# Altium schematic sheet jlink.schdoc
size 309 x 182 mm; Symbol: Sheet-Symbol_A4; Device: Sheet-Symbol_A4; @Page Name: P1; @Create Date: 2023-07-17; @Page Count: 1; @Page No: 1; @Project Name: JLINK_OB_Moriarty; @Schematic Name: Schematic1; @Update Date: 2023-07-19; Company: 黄佩奇; Page Size: A4; Version: V1.0
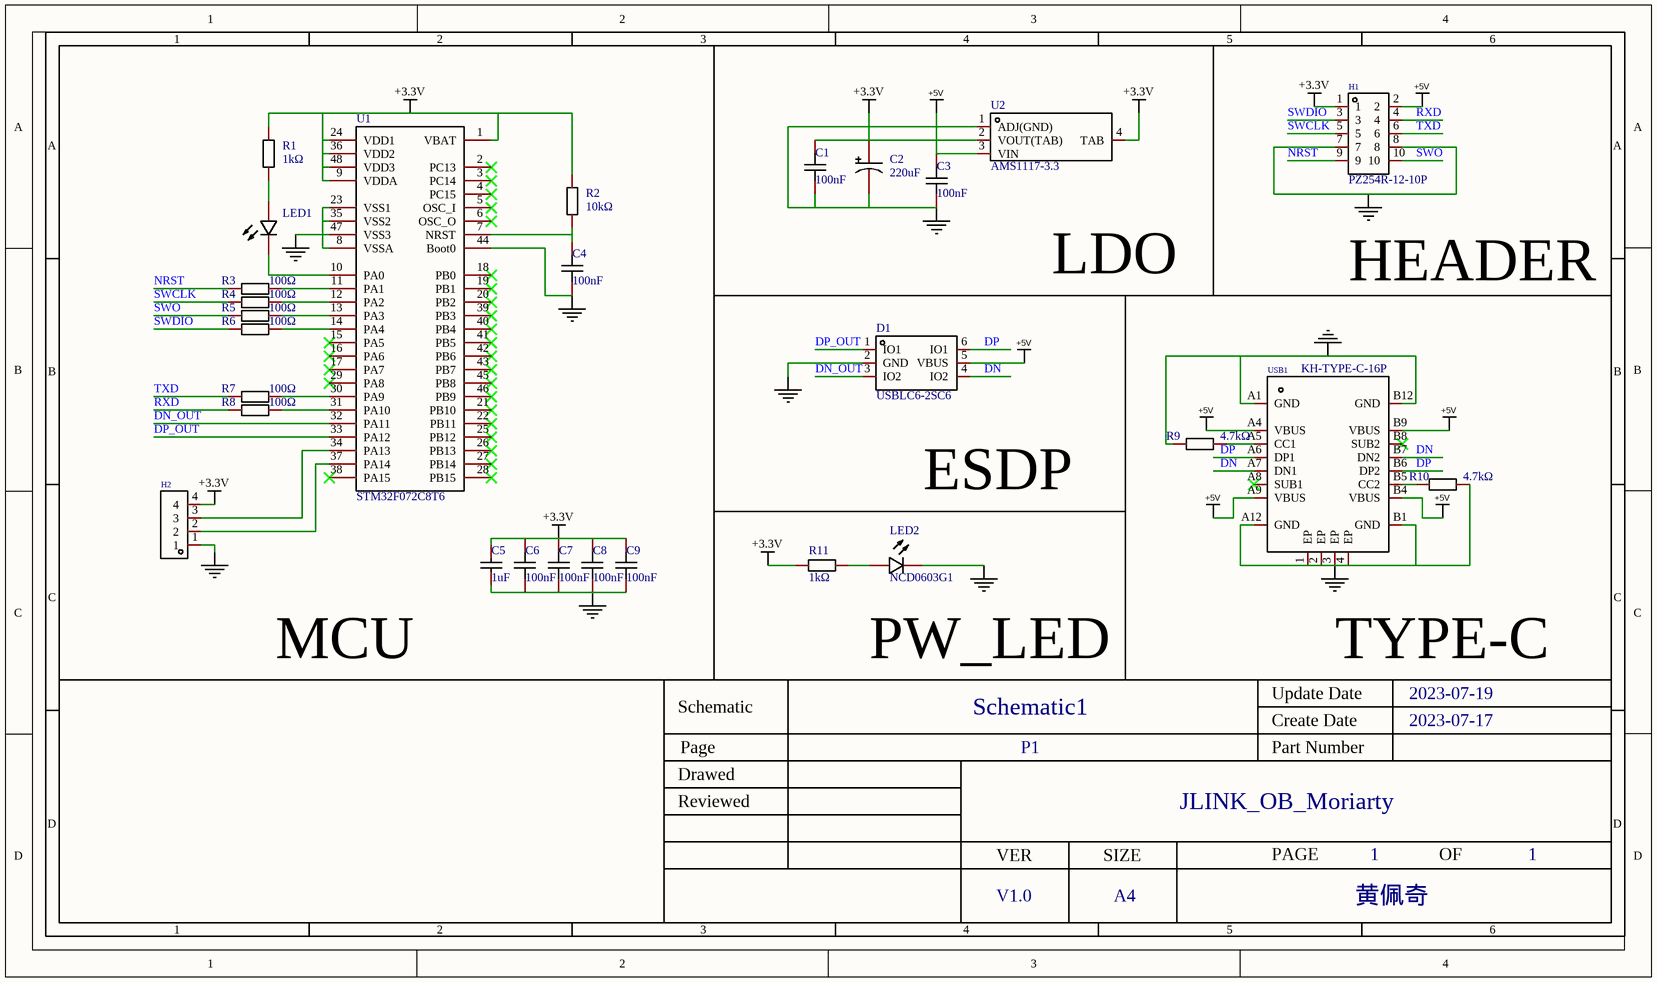
[diagram p0: jlink.schdoc]

## Parts
C1  100nF  [C0603]
C2  220uF  [CAP-SMD_BD10.0-L10.3-W10.3-LS11.3-FD]
C3  100nF  [C0603]
C4  100nF  [C0603]
C5  1uF  [C0603]
C6  100nF  [C0603]
C7  100nF  [C0603]
C8  100nF  [C0603]
C9  100nF  [C0603]
D1  USBLC6-2SC6  [SOT-23-6_L2.9-W1.6-P0.95-LS2.8-BL]
H1  PZ254R-12-10P  [HDR-TH_10P-P2.54-H-M-R2-C5-S2.54]
H2  PZ254V-11-04P  [HDR-TH_4P-P2.54-V-M]  (value not drawn)
LED1  NCD0603W1  [LED0603-RD]  (value not drawn)
LED2  NCD0603G1  [LED0603-RD]
R1  1kΩ  [R0603]
R2  10kΩ  [R0603]
R3  100Ω  [R0603]
R4  100Ω  [R0603]
R5  100Ω  [R0603]
R6  100Ω  [R0603]
R7  100Ω  [R0603]
R8  100Ω  [R0603]
R9  4.7kΩ  [R0603]
R10  4.7kΩ  [R0603]
R11  1kΩ  [R0603]
U1  STM32F072C8T6  [LQFP-48_L7.0-W7.0-P0.50-LS9.0-BL]
U2  AMS1117-3.3  [SOT-223-4_L6.5-W3.5-P2.30-LS7.0-BR]
USB1  KH-TYPE-C-16P  [USB-C-SMD_KH-TYPE-C-16P]

## Nets
+3.3V: C1.2 C2.1 C5.2 C6.2 C7.2 C8.2 C9.2 H1.1 H2.4 R1.2 R2.2 R11.2 U1.1(VBAT) U1.9(VDDA) U1.24(VDD1) U1.36(VDD2) U1.48(VDD3) U2.2(VOUT(TAB)) U2.4(TAB)
+5V: C3.2 D1.5(VBUS) H1.2 U2.3(VIN) USB1.A4(VBUS) USB1.A9(VBUS) USB1.B4(VBUS) USB1.B9(VBUS)
NetC1_1: C1.1 C2.2 C3.1 C4.1 C5.1 C6.1 C7.1 C8.1 C9.1 D1.2(GND) H1.7 H1.8 H2.1 LED2.1(K) R9.2 R10.1 U1.8(VSSA) U1.23(VSS1) U1.35(VSS2) U1.44(Boot0) U1.47(VSS3) U2.1(ADJ(GND)) USB1.1(EP) USB1.2(EP) USB1.3(EP) USB1.4(EP) USB1.A1(GND) USB1.A12(GND) USB1.B1(GND) USB1.B12(GND)
DN: D1.4(IO2) USB1.A7(DN1) USB1.B7(DN2)
DN_OUT: D1.3(IO2) U1.32(PA11)
DP: D1.6(IO1) USB1.A6(DP1) USB1.B6(DP2)
DP_OUT: D1.1(IO1) U1.33(PA12)
NRST: H1.9 R3.2
RXD: H1.4 R8.2
SWCLK: H1.5 R4.2
SWDIO: H1.3 R6.2
SWO: H1.10 R5.2
TXD: H1.6 R7.2
NetC4_2: C4.2 R2.1 U1.7(NRST)
NetH2_2: H2.2 U1.37(PA14)
NetH2_3: H2.3 U1.34(PA13)
NetLED1_1: LED1.1(-) U1.10(PA0)
NetLED1_2: LED1.2(+) R1.1
NetLED2_2: LED2.2(A) R11.1
NetR3_1: R3.1 U1.11(PA1)
NetR4_1: R4.1 U1.12(PA2)
NetR5_1: R5.1 U1.13(PA3)
NetR6_1: R6.1 U1.14(PA4)
NetR7_1: R7.1 U1.30(PA9)
NetR8_1: R8.1 U1.31(PA10)
NetR9_1: R9.1 USB1.A5(CC1)
NetR10_2: R10.2 USB1.B5(CC2)

Not connected (* = marked no-connect by the designer): U1 2(PC13)* 3(PC14)* 4(PC15)* 5(OSC_I)* 6(OSC_O)* 15(PA5)* 16(PA6)* 17(PA7)* 18(PB0)* 19(PB1)* 20(PB2)* 21(PB10)* 22(PB11)* 25(PB12)* 26(PB13)* 27(PB14)* 28(PB15)* 29(PA8)* 38(PA15)* 39(PB3)* 40(PB4)* 41(PB5)* 42(PB6)* 43(PB7)* 45(PB8)* 46(PB9)*; USB1 A8(SUB1)* B8(SUB2)*

## Notes on the sheet
- LDO
- HEADER
- ESDP
- MCU
- PW_LED
- TYPE-C
- 1
- 2
- 3
- 4
- 5
- 6
- A
- B
- C
- Schematic
- Schematic1
- Create Date
- Update Date
- 2023-07-17
- 2023-07-19
- Reviewed
- Drawed
- Page
- P1
- Part Number
- JLINK_OB_Moriarty
- D
- VER
- SIZE
- PAGE
- OF
- V1.0
- A4
- 黄佩奇

## Library data of the parts
C1 C3 C4 C6-C9 = CC0603KRX7R9BB104: 容值:100nF;精度:±10%;额定电压:50V;材质(温度系数):X7R;; Manufacturer: YAGEO(国巨); Add into BOM: yes; Tolerance: ±10%; Voltage Rated: 50V; Temperature Coefficient: X7R; Name: 100nF; Symbol: CC0603KRX7R9BB104; Device: CC0603KRX7R9BB104; LCSC Part Name: 100nF ±10% 50V; Supplier Part: C14663; Manufacturer Part: CC0603KRX7R9BB104; Supplier Footprint: 0603; JLCPCB Part Class: Basic Part; Datasheet: https://atta.szlcsc.com/upload/public/pdf/source/20180910/C282072_33301C7F631E79921B82A8DAC6BCC5B3.pdf; Supplier: LCSC; Convert to PCB: yes; Value: 100nF
C2 = UWT1H221MNL1GS: 容值:220uF;精度:±20%;额定电压:50V;电容体直径:10mm;电容体长度:10mm;纹波电流:-;等效串联电阻:-;工作寿命:1000hrs@105℃;工作温度:-45℃~+105℃;; Manufacturer: Nichicon(尼吉康); Add into BOM: yes; Tolerance: ±20%; Rated Voltage: 50V; φD: 10mm; Name: 220uF; Symbol: UWT1H221MNL1GS; Device: UWT1H221MNL1GS; LCSC Part Name: 220uF ±20% 50V; Supplier Part: C125977; Manufacturer Part: UWT1H221MNL1GS; Supplier Footprint: SMD,D10xL10mm; JLCPCB Part Class: Extended Part; Datasheet: https://atta.szlcsc.com/upload/public/pdf/source/20180326/C125977_E9DF60E16C83D39BAFBC5BA9BCB00758.pdf; Supplier: LCSC; Convert to PCB: yes; Value: 220uF; L: 10mm; Ripple Current: -; Equivalent Series Resistance(ESR): -; Lifetime @ Temp: 1000hrs@105℃; Operating Temperature: -45℃~+105℃
C5 = 0603B105K250NT: 容值:1uF;精度:±10%;额定电压:25V;材质(温度系数):X7R;; Manufacturer: FH(风华); Add into BOM: yes; Tolerance: ±10%; Voltage Rated: 25V; Temperature Coefficient: X7R; Name: 1uF; Symbol: 0603B105K250NT; Device: 0603B105K250NT; LCSC Part Name: 1uF ±10% 25V; Supplier Part: C59302; Manufacturer Part: 0603B105K250NT; Supplier Footprint: 0603; JLCPCB Part Class: Extended Part; Datasheet: https://atta.szlcsc.com/upload/public/pdf/source/20170923/C59302_1506149498957988854.pdf; Supplier: LCSC; Convert to PCB: yes; Value: 1uF
D1 = USBLC6-2SC6_C2827654: USBLC6-2SC6 Vrwm:5V 印记：UL26  ESD静电管静电放电(ESD)保护器件; Manufacturer: TECH PUBLIC(台舟); Add into BOM: yes; Name: USBLC6-2SC6; Symbol: USBLC6-2SC6_C2827654; Device: USBLC6-2SC6_C2827654; LCSC Part Name: USBLC6-2SC6; Supplier Part: C2827654; Manufacturer Part: USBLC6-2SC6; Supplier Footprint: SOT-23-6; JLCPCB Part Class: Extended Part; Datasheet: https://atta.szlcsc.com/upload/public/pdf/source/20210810/FBD75DE717D6D97BAC6DD7F2B5C09DCD.pdf; Supplier: LCSC; Convert to PCB: yes
H1 = PZ254R-12-10P: 排数:双排;总PIN位数:10P;间距:2.54mm;插针结构:2x5P;行距:2.54mm;安装类型:弯插;圆针/方针:方针;额定电流:-;额定电压:-;配合针长度:6mm;塑高:2.5mm;触头材质:黄铜;触头镀层:-;工作温度范围:-40℃~+105℃;颜色:黑色;; Manufacturer: XFCN(兴飞); Add into BOM: yes; Pitch: 2.54mm; Pin Structure: 2x5P; Circluar Pins/Square Pins: 方针; Name: PZ254R-12-10P; Symbol: PZ254R-12-10P; Device: PZ254R-12-10P; LCSC Part Name: 2.54mm 2x5P 弯插 方针; Supplier Part: C492433; Manufacturer Part: PZ254R-12-10P; Supplier Footprint: 弯插,P=2.54mm; JLCPCB Part Class: Extended Part; Datasheet: https://atta.szlcsc.com/upload/public/pdf/source/20200309/C492433_E1DF9BC45CD746DC26B2517D82EEBDA7.pdf; Supplier: LCSC; Convert to PCB: yes; Number of Rows: 双排; Number of Pins: 10P; Row Spacing: 2.54mm; Mounting Type: 弯插; Current Rating (Max): -; Voltage Rating (Max): -; Length of Mating Pin: 6mm; Insulation Height: 2.5mm; Contact Material: 黄铜; Contact Plating: -; Operating Temperature Range: -40℃~+105℃; Color: 黑色
H2 = PZ254V-11-04P: 排数:单排;总PIN位数:4P;间距:2.54mm;插针结构:1x4P;行距:-;安装类型:直插;圆针/方针:方针;额定电流:3A;额定电压:250V;配合针长度:6mm;塑高:2.5mm;端接针长度:3mm;触头材质:-;工作温度范围:-40℃~+105℃;颜色:黑色;; Manufacturer: XFCN(兴飞); Symbol: PZ254V-11-04P_C2691448; Add into BOM: yes; Pitch: 2.54mm; Pin Structure: 1x4P; Circluar Pins/Square Pins: 方针; Current Rating (Max): 3A; Voltage Rating (Max): 250V; Name: PZ254V-11-04P; Device: PZ254V-11-04P; LCSC Part Name: 2.54mm 1x4P 直插 方针; Supplier Part: C2691448; Manufacturer Part: PZ254V-11-04P; Supplier Footprint: 插件,P=2.54mm; JLCPCB Part Class: Extended Part; Datasheet: https://atta.szlcsc.com/upload/public/pdf/source/20200309/C492403_F9F19131791D08044AD4F84F8E751A34.pdf; Supplier: LCSC; Convert to PCB: yes; Number of Rows: 单排; Number of Pins: 4P; Row Spacing: -; Mounting Type: 直插; Length of Mating Pin: 6mm; Insulation Height: 2.5mm; Length of End Connection Pin: 3mm; Contact Material: -; Operating Temperature Range: -40℃~+105℃; Color: 黑色
LED1 = NCD0603W1: 发光颜色:白灯;; Manufacturer: 国星光电; Symbol: FC-D1608WD-460H5; Add into BOM: yes; Emitted Color: 白灯; Name: NCD0603W1; Device: NCD0603W1; LCSC Part Name: NCD0603W1; Supplier Part: C84265; Manufacturer Part: NCD0603W1; Supplier Footprint: 0603; JLCPCB Part Class: Extended Part; Datasheet: https://atta.szlcsc.com/upload/public/pdf/source/20200820/C84265_479E6193713348A548E5CD6D9278BF16.pdf; Supplier: LCSC; Convert to PCB: yes
LED2 = NCD0603G1: 发光颜色:翠绿;; Manufacturer: 国星光电; Symbol: FC-D1608UGK-520D10; Add into BOM: yes; Emitted Color: 翠绿; Name: NCD0603G1; Device: NCD0603G1; LCSC Part Name: 翠绿; Supplier Part: C84267; Manufacturer Part: NCD0603G1; Supplier Footprint: 0603; JLCPCB Part Class: Extended Part; Datasheet: https://atta.szlcsc.com/upload/public/pdf/source/20200820/C84267_04BA7703640BAC111D09F5EFB971FBF3.pdf; Supplier: LCSC; Convert to PCB: yes
R1 R11 = 0603WAF1001T5E: 电阻类型:厚膜电阻;阻值:1kΩ;精度:±1%;功率:100mW;; Manufacturer: UNI-ROYAL(厚声); Add into BOM: yes; Tolerance: ±1%; Power(Watts): 100mW; Temperature Coefficient: ±100ppm/℃; Overload Voltage (Max): 75V; Name: 1kΩ; Symbol: 0603WAF1001T5E; Device: 0603WAF1001T5E; LCSC Part Name: 1kΩ ±1% 100mW; Supplier Part: C21190; Manufacturer Part: 0603WAF1001T5E; Supplier Footprint: 0603; JLCPCB Part Class: Basic Part; Datasheet: https://atta.szlcsc.com/upload/public/pdf/source/20200306/C422600_1E6D84923E4A46A82E41ADD87F860B5C.pdf; Supplier: LCSC; Convert to PCB: yes; Type: 厚膜电阻; Value: 1kΩ; Operating Temperature Range: -55℃~+155℃
R2 = 0603WAF1002T5E: 电阻类型:厚膜电阻;阻值:10kΩ;精度:±1%;功率:100mW;; Manufacturer: UNI-ROYAL(厚声); Add into BOM: yes; Tolerance: ±1%; Power(Watts): 100mW; Temperature Coefficient: ±100ppm/℃; Overload Voltage (Max): 75V; Name: 10kΩ; Symbol: 0603WAF1002T5E; Device: 0603WAF1002T5E; LCSC Part Name: 厚膜电阻 10kΩ ±1% 100mW; Supplier Part: C25804; Manufacturer Part: 0603WAF1002T5E; Supplier Footprint: 0603; JLCPCB Part Class: Basic Part; Datasheet: https://atta.szlcsc.com/upload/public/pdf/source/20200306/C422600_1E6D84923E4A46A82E41ADD87F860B5C.pdf; Supplier: LCSC; Convert to PCB: yes; Type: 厚膜电阻; Value: 10kΩ; Operating Temperature Range: -55℃~+155℃
R3-R8 = 0603WAF1000T5E: 电阻类型:厚膜电阻;阻值:100Ω;精度:±1%;功率:100mW;; Manufacturer: UNI-ROYAL(厚声); Add into BOM: yes; Tolerance: ±1%; Power(Watts): 100mW; Temperature Coefficient: ±200ppm/℃; Overload Voltage (Max): 75V; Name: 100Ω; Symbol: 0603WAF1000T5E; Device: 0603WAF1000T5E; LCSC Part Name: 100Ω ±1% 100mW; Supplier Part: C22775; Manufacturer Part: 0603WAF1000T5E; Supplier Footprint: 0603; JLCPCB Part Class: Basic Part; Datasheet: https://atta.szlcsc.com/upload/public/pdf/source/20200306/C422600_1E6D84923E4A46A82E41ADD87F860B5C.pdf; Supplier: LCSC; Convert to PCB: yes; Type: 厚膜电阻; Value: 100Ω; Operating Temperature Range: -55℃~+155℃
R9 R10 = 0603WAF4701T5E: 电阻类型:厚膜电阻;阻值:4.7kΩ;精度:±1%;功率:100mW;; Manufacturer: UNI-ROYAL(厚声); Add into BOM: yes; Tolerance: ±1%; Power(Watts): 100mW; Temperature Coefficient: ±100ppm/℃; Overload Voltage (Max): 75V; Name: 4.7kΩ; Symbol: 0603WAF4701T5E; Device: 0603WAF4701T5E; LCSC Part Name: 4.7kΩ ±1% 100mW; Supplier Part: C23162; Manufacturer Part: 0603WAF4701T5E; Supplier Footprint: 0603; JLCPCB Part Class: Basic Part; Datasheet: https://atta.szlcsc.com/upload/public/pdf/source/20200306/C422600_1E6D84923E4A46A82E41ADD87F860B5C.pdf; Supplier: LCSC; Convert to PCB: yes; Type: 厚膜电阻; Value: 4.7kΩ; Operating Temperature Range: -55℃~+155℃
U1 = STM32F072C8T6: Manufacturer: ST(意法半导体); Add into BOM: yes; Name: STM32F072C8T6; Symbol: STM32F072C8T6; Device: STM32F072C8T6; LCSC Part Name: STM32F072C8T6; Supplier Part: C80488; Manufacturer Part: STM32F072C8T6; Supplier Footprint: LQFP-48(7x7); JLCPCB Part Class: Extended Part; Datasheet: https://atta.szlcsc.com/upload/public/pdf/source/20160816/1471343013459.pdf; Supplier: LCSC; Convert to PCB: yes
U2 = AMS1117-3.3_C347222: 输出类型:固定;输出极性:正;最大输入电压:18V;输出电压:3.3V;输出电流:1A;电源纹波抑制比(PSRR):60dB@(120Hz);; Manufacturer: UMW(广东友台半导体); Add into BOM: yes; Output Type: 固定; Output Polarity: 正; Number of Outputs: 1; Maximum Input Voltage: 18V; Output Voltage: 3.3V; Dropout Voltage: 1.3V@(1A); Output Current: 1A; Name: AMS1117-3.3; Symbol: AMS1117-3.3_C347222; Device: AMS1117-3.3_C347222; LCSC Part Name: AMS1117-3.3; Supplier Part: C347222; Manufacturer Part: AMS1117-3.3; Supplier Footprint: SOT-223; JLCPCB Part Class: Extended Part; Datasheet: https://atta.szlcsc.com/upload/public/pdf/source/20211011/50CC665C22E3A66C08379A4A74BDA25C.pdf; Supplier: LCSC; Convert to PCB: yes; Power Supply Rejection Ratio (PSRR): 60dB@(120Hz)
USB1 = KH-TYPE-C-16P: Type-C母座 16PIN 立式四角贴板无压片; Manufacturer: kinghelm(金航标); Add into BOM: yes; Name: KH-TYPE-C-16P; Symbol: KH-TYPE-C-16P; Device: KH-TYPE-C-16P; LCSC Part Name: Type-C母座; Supplier Part: C709357; Manufacturer Part: KH-TYPE-C-16P; Supplier Footprint: -; JLCPCB Part Class: Extended Part; Supplier: LCSC; Convert to PCB: yes